# EAGLE design controler_bot_appli (EAGLE 5.04)
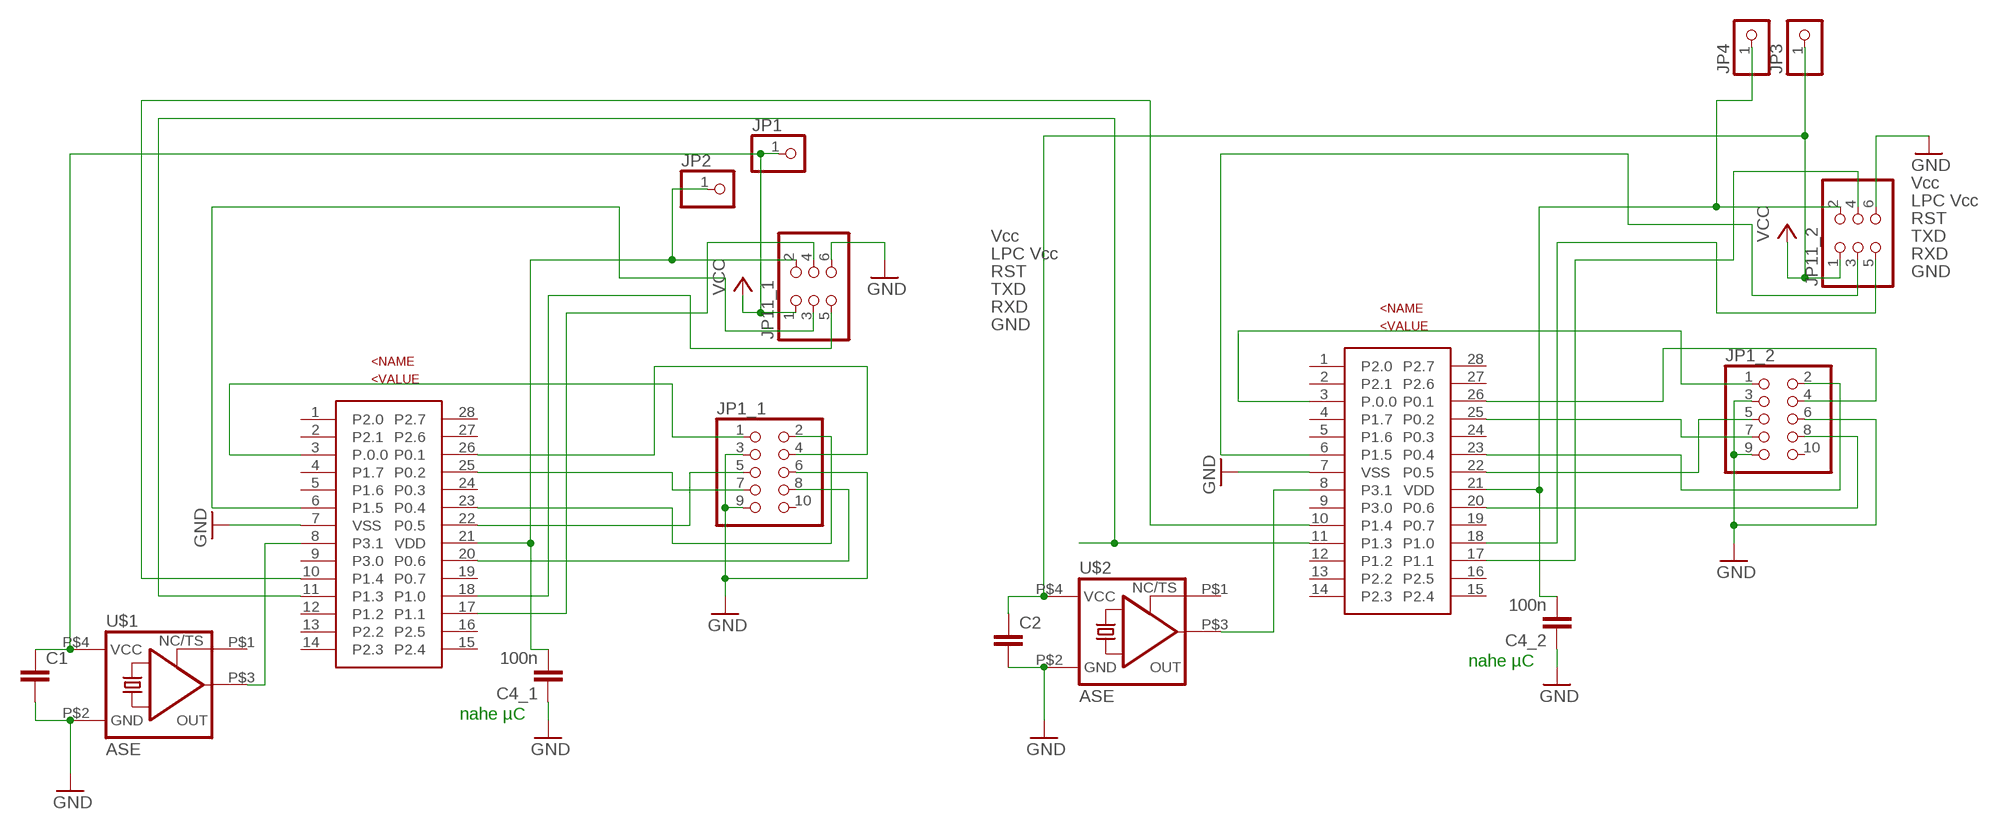
[diagram p0: schematic, sheet 1]

## Parts
C1  C-EUC0805  [C0805]
C2  C-EUC0805  [C0805]
C4_1  100n  C-EUC1206  [C1206]
C4_2  100n  C-EUC1206  [C1206]
JP1  PINHD-1X1  [1X01]
JP1_1  PINHD-2X5  [2X05]
JP1_2  PINHD-2X5  [2X05]
JP2  PINHD-1X1  [1X01]
JP3  PINHD-1X1  [1X01]
JP4  PINHD-1X1  [1X01]
JP11_1  PINHD-2X3  [2X03]
JP11_2  PINHD-2X3  [2X03]
U1_1  LPC936TSSOP28  [TSSOP28]
U1_2  LPC936TSSOP28  [TSSOP28]
U$1  ASE  [ASE]
U$2  ASE  [ASE]

## Nets
EIBIN: U1_1.10(P1.4) U1_2.10(P1.4)
GND: C1.2 C2.2 C4_1.1 C4_2.1 JP1_1.3 JP1_1.6 JP1_1.9 JP1_2.3 JP1_2.6 JP1_2.9 JP11_1.6 JP11_2.6 U1_1.7(VSS) U1_2.7(VSS) U$1.P$2(GND) U$2.P$2(GND)
N$2: U1_1.8(P3.1) U$1.P$3(OUT)
N$3: U1_2.8(P3.1) U$2.P$3(OUT)
P0.0: JP1_1.1 U1_1.3(P.0.0)
P0.1: JP1_1.4 U1_1.26(P0.1)
P0.2: JP1_1.7 U1_1.25(P0.2)
P0.3: JP1_2.1 U1_2.3(P.0.0)
P0.4: JP1_1.2 U1_1.23(P0.4)
P0.5: JP1_2.4 U1_2.26(P0.1)
P0.6: JP1_1.8 U1_1.20(P0.6)
P0.7: JP1_2.7 U1_2.25(P0.2)
P0.8: JP1_2.2 U1_2.23(P0.4)
P0.9: JP1_2.8 U1_2.20(P0.6)
P0_1: JP1_2.5 U1_2.22(P0.5)
P0_5: JP1_1.5 U1_1.22(P0.5)
RST: JP11_1.3 U1_1.6(P1.5)
RST1: JP11_2.3 U1_2.6(P1.5)
RXD: JP11_1.5 U1_1.18(P1.0)
RXD1: JP11_2.5 U1_2.18(P1.0)
SYNC: U1_1.11(P1.3) U1_2.11(P1.3)
TXD: JP11_1.4 U1_1.17(P1.1)
TXD1: JP11_2.4 U1_2.17(P1.1)
VCC: C1.1 C2.1 JP1.1 JP3.1 JP11_1.1 JP11_2.1 U$1.P$4(VCC) U$2.P$4(VCC)
VCC_LPC: C4_1.2 JP2.1 JP11_1.2 U1_1.21(VDD)
VCC_LPC1: C4_2.2 JP4.1 JP11_2.2 U1_2.21(VDD)
Unconnected: JP1_1.10 JP1_2.10 U1_1.1(P2.0) U1_1.2(P2.1) U1_1.4(P1.7) U1_1.5(P1.6) U1_1.9(P3.0) U1_1.12(P1.2) U1_1.13(P2.2) U1_1.14(P2.3) U1_1.15(P2.4) U1_1.16(P2.5) U1_1.19(P0.7) U1_1.24(P0.3) U1_1.27(P2.6) U1_1.28(P2.7) U1_2.1(P2.0) U1_2.2(P2.1) U1_2.4(P1.7) U1_2.5(P1.6) U1_2.9(P3.0) U1_2.12(P1.2) U1_2.13(P2.2) U1_2.14(P2.3) U1_2.15(P2.4) U1_2.16(P2.5) U1_2.19(P0.7) U1_2.24(P0.3) U1_2.27(P2.6) U1_2.28(P2.7) U$1.P$1(TS) U$2.P$1(TS)

## Notes on the sheet
- Vcc
- LPC Vcc
- RST
- Vcc | TXD
- LPC Vcc | RXD
- RST | GND
- TXD
- RXD
- GND
- nahe µC
- nahe µC

## Library data of the parts
C1 C2 C4_1 C4_2 = rcl:C-EU: CAPACITOR, European symbol
JP1-JP4 = pinhead:PINHD-1X1: PIN HEADER
JP1_1 JP1_2 = pinhead:PINHD-2X5: PIN HEADER
JP11_1 JP11_2 = pinhead:PINHD-2X3: PIN HEADER
U1_1 U1_2 = freebuslpc:LPC936: C51 Based Microcontroller LPC936 ADC and 16kbyte Flash
U$1 U$2 = crystal:ASE

## Board
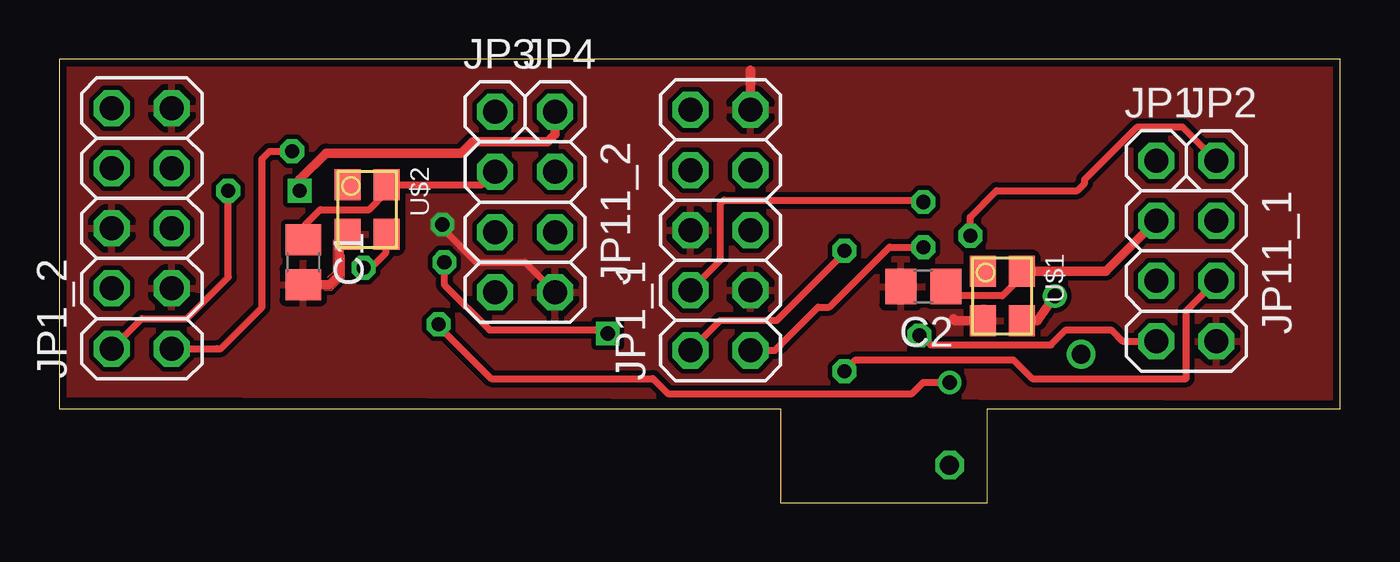
[diagram p1: board, top side]
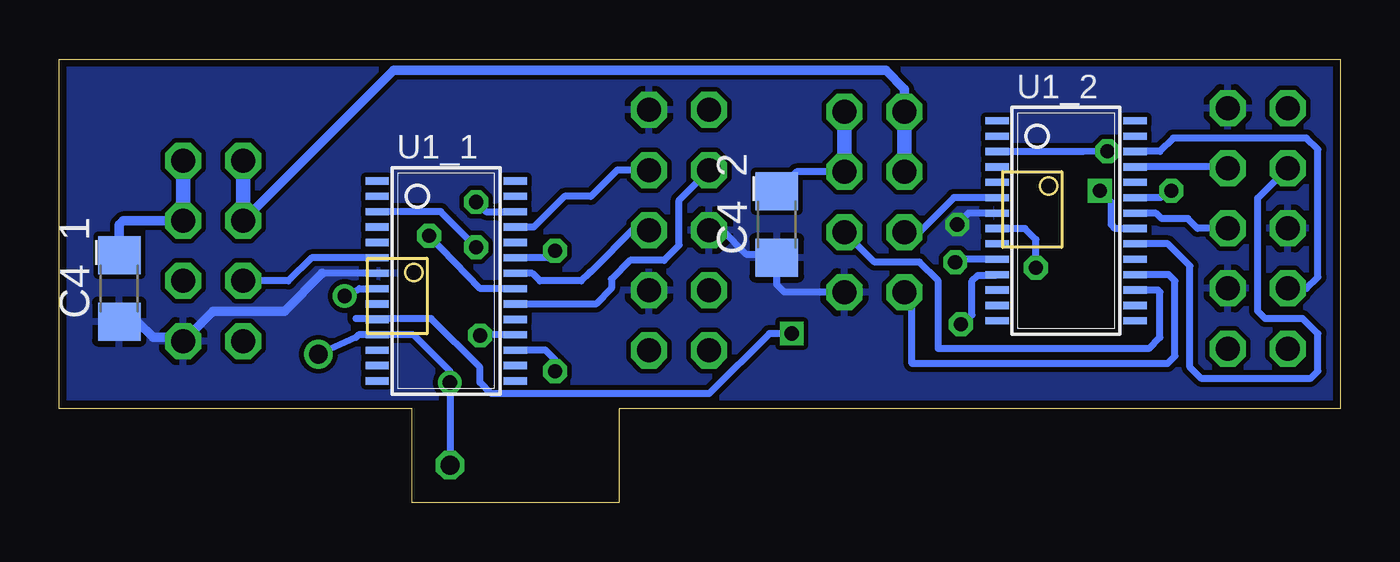
[diagram p2: board, bottom side, seen from below]

Size 54.13 x 18.73 mm. Coordinates in mm from the lower left corner, seen from the top.
Outline: 54.13,3.97 54.13,18.73 0,18.73 0,3.97 30.48,3.97 30.48,0 39.21,0 39.21,3.97 54.13,3.97
Copper layers (1*16): Top 0.035mm / dielectric 1.5mm / Bottom 0.035mm
Design rules "default *": minimum track width 10mil, minimum drill 12mil, track to track 8mil, track to pad 8mil, pad to pad 16mil, via to via 16mil, smd to smd 4mil, copper to edge 12mil, drill to drill 10mil, minimum pad ring 10mil, minimum via ring 8mil, stop-mask expansion 4mil, vias tented up to drill 0mil, thermal gap 10mil

### Footprints (pad centres in the part's own frame; a part is rotated, then mirrored left to right if it is on the bottom)
C0805 = smd 1.3 x 1.5: 1 -0.95,0; 2 0.95,0
C1206 = smd 1.6 x 1.8: 1 -1.4,0; 2 1.4,0
1X01 = drill 1.016 octagon: 1 0,0
2X05 = drill 1.016 octagon: 1 -5.08,-1.27; 2 -5.08,1.27; 3 -2.54,-1.27; 4 -2.54,1.27; 5 0,-1.27; 6 0,1.27; 7 2.54,-1.27; 8 2.54,1.27; 9 5.08,-1.27; 10 5.08,1.27
2X03 = drill 1.016 octagon: 1 -2.54,-1.27; 2 -2.54,1.27; 3 0,-1.27; 4 0,1.27; 5 2.54,-1.27; 6 2.54,1.27
TSSOP28 = smd 0.305 x 0.991: 1 -4.225,-2.918; 2 -3.575,-2.918; 3 -2.925,-2.918; 4 -2.275,-2.918; 5 -1.625,-2.918; 6 -0.975,-2.918; 7 -0.325,-2.918; 8 0.325,-2.918; 9 0.975,-2.918; 10 1.625,-2.918; 11 2.275,-2.918; 12 2.925,-2.918; 13 3.575,-2.918; 14 4.225,-2.918; 15 4.225,2.918; 16 3.575,2.918; 17 2.925,2.918; 18 2.275,2.918; 19 1.625,2.918; 20 0.975,2.918; 21 0.325,2.918; 22 -0.325,2.918; 23 -0.975,2.918; 24 -1.625,2.918; 25 -2.275,2.918; 26 -2.925,2.918; 27 -3.575,2.918; 28 -4.225,2.918
ASE = smd 1.3 x 1.1: P$1 -1.05,-0.825; P$2 1.05,-0.825; P$3 1.05,0.825; P$4 -1.05,0.825

### Placement (x,y rotation side)
C1  10.32,10.16 270 top
C2  36.51,9.13 180 top
C4_1  51.59,9.05 90 bottom
C4_2  23.81,11.75 90 bottom
JP1  46.35,14.45 0 top
JP1_1  27.94,11.51 90 top
JP1_2  3.49,11.59 90 top
JP2  48.89,14.45 0 top
JP3  18.41,16.51 0 top
JP4  20.95,16.51 0 top
JP11_1  47.62,9.37 270 top
JP11_2  19.68,11.43 270 top
U1_1  37.78,9.37 270 bottom
U1_2  11.59,11.91 270 bottom
U$1  39.85,8.73 270 top
U$2  13.02,12.38 270 top

### Tracks (layer width: path | path; a pad name or v marks a point on that pad's centre or on a via)
EIBIN  (via drill 0.6)
  Top 0.305: v16.27,10.16 16.27,9.21 18.18,7.3 23.02,7.3 v23.18,7.14
  Bottom 0.305: U1_2.10 15.83,10.28 v16.27,10.16 | v23.18,7.14 24.13,7.14 26.67,4.6 35.88,4.6 36.35,5.08 36.35,5.72 38.42,7.78 40.74,7.78 | 40.74,7.78 41.59,7.78 | 40.74,7.78 U1_1.10
GND  (via drill 0.6)
  Top 0.305: v16.19,11.75 16.19,11.59 17.62,10.16 19.69,10.16 JP11_2.6 | U$2.P$2 11.88,10.76
  Top 0.406: JP1_1.9 29.21,18.26 | U$1.P$2 37.84,7.68 37.78,7.78 | C1.2 11.43,9.21 11.83,9.6 11.83,10.89 U$2.P$2
  Bottom 0.305: U1_2.7 15.71,12.23 v16.19,11.75 | JP11_2.6 23.49,8.89 23.81,9.21 C4_2.1 23.94,10.48 25.08,10.48 26.11,11.51 JP1_1.6 | U1_1.7 43.01,9.69
  Bottom 0.406: C4_1.1 50.83,7.65 50.16,6.99 49.05,6.99 JP11_1.6 47.62,8.1 44.61,8.1 43.01,9.69
  pour Bottom: -0.64,18.57 -0.48,4.45 55.24,4.45 55.09,18.57
  pour Top: -0.16,18.89 0,4.6 54.45,4.44 54.29,18.73
N$2  (via drill 0.6)
  Top 0.406: U$1.P$3 41.34,7.68 v42.07,8.73
  Bottom 0.305: U1_1.8 41.44,9.04 v42.07,8.73
N$3  (via drill 0.6)
  Top 0.305: U$2.P$3 13.81,11.3 13.81,10.56 13.33,10.08 v12.86,9.92
  Bottom 0.305: U1_2.8 13.33,11.58 12.86,11.11 v12.86,9.92
N$4
  Top 0: 12.06,10.48 12.06,9.53 11.51,8.97 11.19,8.97
N$5
  Top 0: 11.59,11.11 11.59,9.76 11.35,9.53
P0.0  (via drill 0.6)
  Top 0.305: v36.51,10.8 35.08,10.8 32.54,8.26 32.07,8.26 30.48,6.67 30.24,6.43 JP1_1.1
  Bottom 0.305: U1_1.3 38.01,12.29 v36.51,10.8
P0.1  (via drill 0.6)
  Top 0.305: v36.51,12.7 36.43,12.7 36.35,12.78 28.1,12.78 27.94,12.62 27.94,10.24 JP1_1.4
  Bottom 0.305: U1_1.26 36.1,12.29 v36.51,12.7
P0.2
  Bottom 0.305: U1_1.25 34.08,11.64 32.78,12.94 31.67,12.94 30.56,14.05 JP1_1.7
P0.3  (via drill 0.6)
  Top 0.305: v9.84,14.84 8.89,14.84 8.57,14.53 8.57,8.26 6.83,6.51 6.67,6.51 JP1_2.1
  Bottom 0.305: U1_2.3 10.86,14.83 v9.84,14.84
P0.4  (via drill 0.6)
  Top 0.305: v33.18,10.64 33.18,10.56 30.32,7.7 27.94,7.7 JP1_1.2
  Bottom 0.305: U1_1.23 33.47,10.34 v33.18,10.64
P0.5
  Bottom 0.305: U1_2.26 8.58,14.84 7.62,14.84 7.06,15.4 1.43,15.4 0.95,14.92 0.95,9.53 1.43,9.05 JP1_2.4 | JP1_2.4
P0.6
  Bottom 0.305: U1_1.20 31.46,8.39 30.8,9.05 30.8,9.45 30,10.24 28.58,10.24 27.94,10.87 27.94,12.78 JP1_1.8
P0.7
  Bottom 0.305: U1_2.25 4.76,14.18 JP1_2.7
P0.8  (via drill 0.6)
  Top 0.305: v7.14,13.18 7.14,9.53 5.4,7.78 3.49,7.78 JP1_2.2
  Bottom 0.305: U1_2.23 7.6,12.88 v7.14,13.18
P0.9
  Bottom 0.305: U1_2.20 7.28,10.93 6.35,10 6.35,5.72 5.87,5.24 1.27,5.24 0.95,5.56 0.95,7.14 1.59,7.78 3.18,7.78 3.49,8.1 3.49,12.86 JP1_2.8
P0_1
  Bottom 0.305: U1_2.22 7.78,12.22 7.55,11.99 6.44,11.99 6.03,11.59 JP1_2.5 | JP1_2.5
P0_5
  Bottom 0.305: U1_1.22 34.13,9.68 33.82,9.37 32.07,9.37 31.75,9.68 31.67,9.76 29.85,11.59 29.21,11.59 JP1_1.5
RST
  Bottom 0.305: U1_1.6 43.48,10.34 44.45,9.37 JP11_1.3
RST1
  Bottom 0.305: U1_2.6 16.33,12.88 17.78,11.43 JP11_2.3
RXD  (via drill 0.6)
  Top 0.305: v36.35,7.06 36.83,6.67 41.91,6.67 42.55,7.3 44.45,7.3 44.93,6.83 JP11_1.5
  Bottom 0.305: U1_1.18 35.98,7.09 v36.35,7.06
RXD1
  Bottom 0.305: U1_2.18 7.25,9.63 6.98,9.37 6.98,6.19 7.3,5.87 18.1,5.87 18.1,8.57 JP11_2.5
SYNC  (via drill 0.6, 0.8)
  Top 0.305: v37.62,5.08 36.51,5.08 36.04,4.6 25.72,4.6 25.08,5.24 18.26,5.24 16.03,7.46 v16.03,7.54
  Bottom 0.305: v37.62,1.59 v37.62,5.08 37.62,5.56 39.16,7.09 U1_1.11 41.49,7.09 41.59,6.99 v43.18,6.27 | U1_2.11 14.56,9.6 15.32,9.6 15.56,9.37 15.56,7.94 15.95,7.54 v16.03,7.54
TXD  (via drill 0.6)
  Top 0.305: JP11_1.4 47.62,8.1 47.62,5.24 41.12,5.24 40.32,6.03 33.66,6.03 v33.18,5.56
  Bottom 0.305: U1_1.17 33.59,6.44 33.18,6.03 v33.18,5.56
TXD1
  Bottom 0.305: U1_2.17 7.71,8.98 7.62,8.89 7.62,6.99 8.1,6.51 16.99,6.51 16.99,9.37 17.78,10.16 19.69,10.16 JP11_2.4
VCC
  Top 0.305: JP11_2.1 17.88,13.43 U$2.P$4 13.84,13.13 13.1,12.38 11.03,12.38 10.4,11.75 10.4,11.19 C1.1 | 40.8,9.91 U$1.P$4 40.67,9.56 39.85,8.73 37.86,8.73 C2.1
  Top 0.406: U$1.P$4 44.23,9.78 JP11_1.1
  Bottom 0.406: JP11_2.1 18.42,14.45 | JP11_1.1 40,18.26 19.21,18.26 18.42,17.46 JP3.1
  Bottom 0.61: JP11_1.1 JP1.1 | JP3.1 JP11_2.1
VCC_LPC  (via drill 0.6)
  Top 0.305: v38.5,11.27 38.5,12.07 39.61,13.18 43.02,13.18 43.34,13.49 43.34,13.65 45.56,15.88 47.47,15.88 JP2.1
  Bottom 0.305: U1_1.21 36.35,9.04 v38.5,11.27
  Bottom 0.406: C4_1.2 51.59,11.75 51.44,11.91 JP11_1.2
  Bottom 0.61: JP2.1 JP11_1.2
VCC_LPC1  (via drill 0.6)
  Top 0.305: v10.16,13.18 10.16,13.34
  Top 0.406: JP4.1 20.96,15.56 20.64,15.24 17.46,15.24 16.99,14.76 11.27,14.76 10.16,13.65 v10.16,13.18
  Bottom 0.305: JP11_2.2 22.99,13.97 C4_2.2 | U1_2.21 9.52,11.58 9.68,11.75 9.68,12.7 v10.16,13.18
  Bottom 0.61: JP11_2.2 JP4.1